# EAGLE design watch mb (EAGLE 9.6.2)
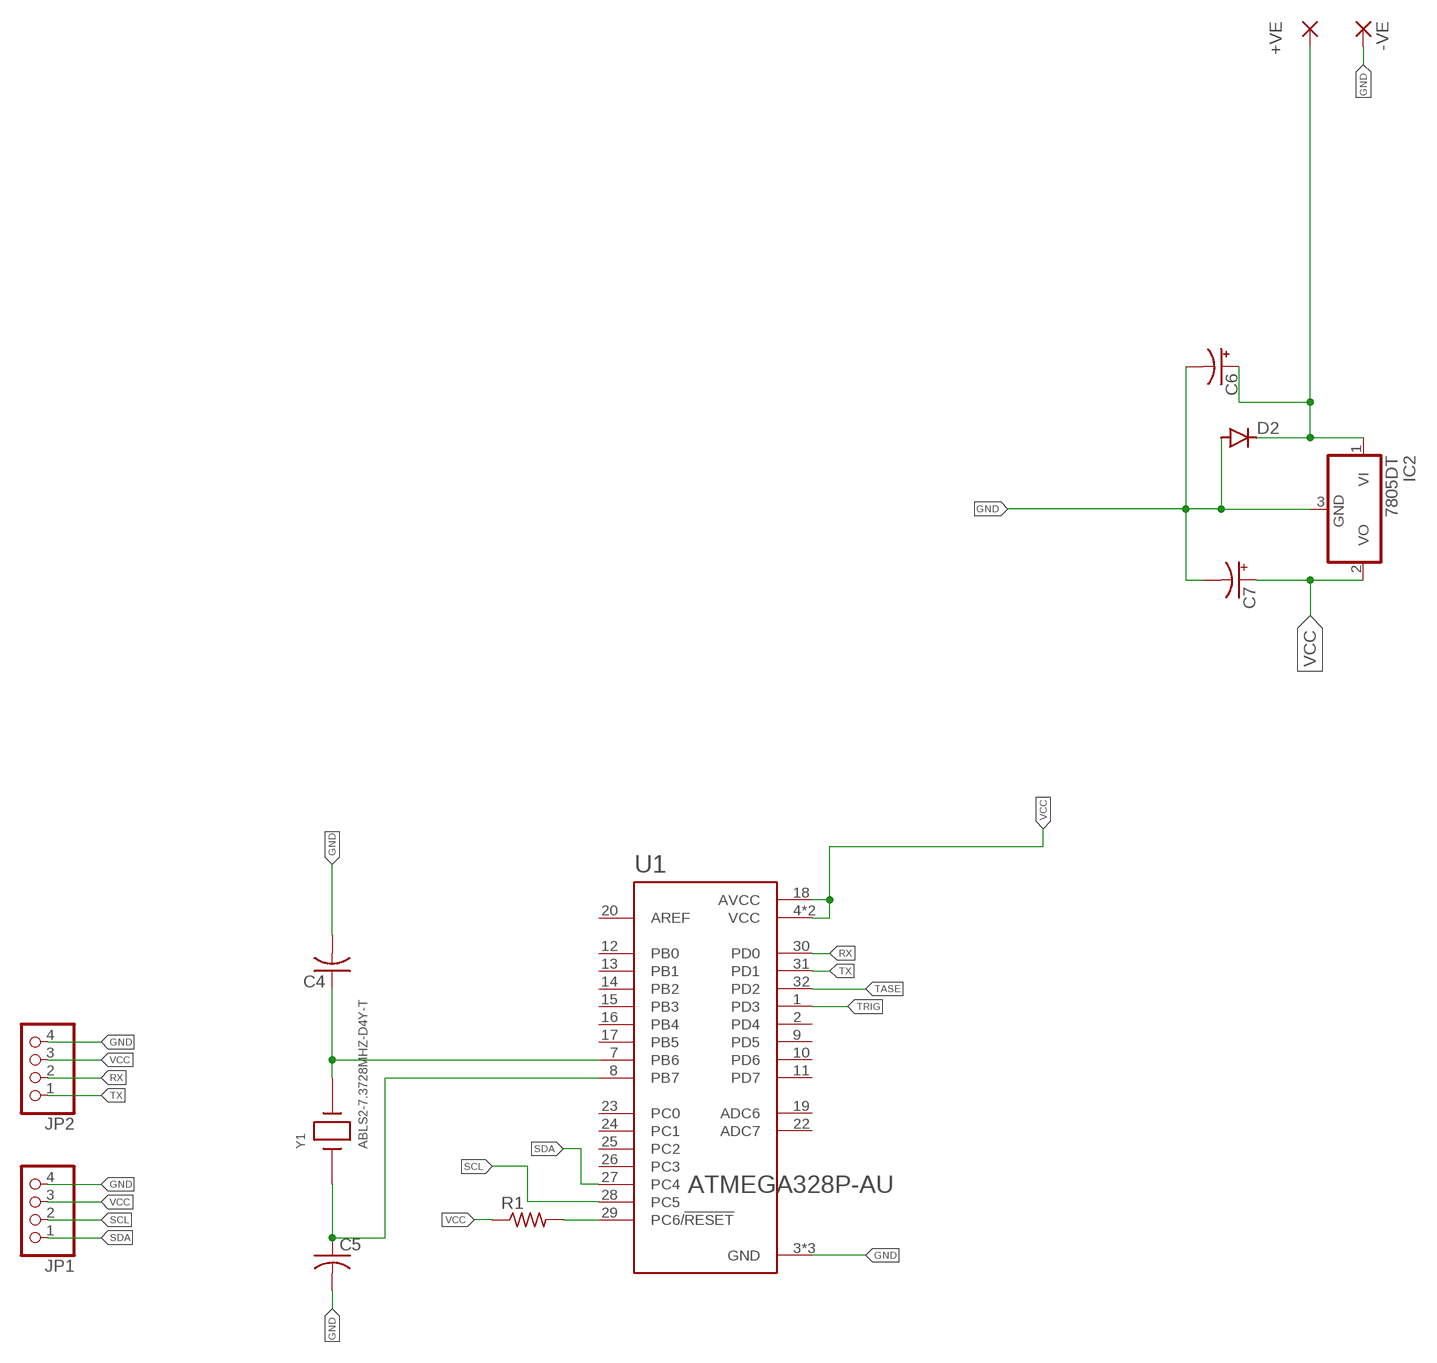
[diagram p0: schematic, sheet 1]

## Parts
+VE  WIREPAD1,6/0,8  [1,6/0,8]
-VE  WIREPAD1,6/0,8  [1,6/0,8]
C4  C-US025-024X044  [C025-024X044]
C5  C-US025-024X044  [C025-024X044]
C6  CPOL-US153CLV-1010  [153CLV-1010]
C7  CPOL-US153CLV-1010  [153CLV-1010]
D2  DIODE-DO214AC  [DO214AC]
IC2  7805DT  [TO252]
JP1  PINHD-1X4  [1X04]
JP2  PINHD-1X4  [1X04]
R1  R-US_R0603  [R0603]
U1  ATMEGA328P-AU  [QFP80P900X900X120-32N]
Y1  ABLS2-7.3728MHZ-D4Y-T  [XTAL_ABLS2-7.3728MHZ-D4Y-T]

## Nets
GND: -VE.1(P) C4.2 C5.2 C6.- C7.- D2.A IC2.3(GND) JP1.4 JP2.4 U1.3(GND) U1.5(GND) U1.21(GND)
N$1: +VE.1(P) C6.+ D2.C IC2.1(VI)
N$3: C4.1 U1.7(PB6) Y1.2
N$5: C5.1 U1.8(PB7) Y1.1
N$7: R1.2 U1.29(PC6/!RESET)
RX: JP2.2 U1.30(PD0)
SCL: JP1.2 U1.28(PC5)
SDA: JP1.1 U1.27(PC4)
TASE: U1.32(PD2)
TRIG: U1.1(PD3)
TX: JP2.1 U1.31(PD1)
VCC: C7.+ IC2.2(VO) JP1.3 JP2.3 R1.1 U1.4(VCC) U1.6(VCC) U1.18(AVCC)
Unconnected: U1.2(PD4) U1.9(PD5) U1.10(PD6) U1.11(PD7) U1.12(PB0) U1.13(PB1) U1.14(PB2) U1.15(PB3) U1.16(PB4) U1.17(PB5) U1.19(ADC6) U1.20(AREF) U1.22(ADC7) U1.23(PC0) U1.24(PC1) U1.25(PC2) U1.26(PC3)

## Library data of the parts
+VE -VE = wirepad:WIREPAD: Wire PAD connect wire on PCB
C4 C5 = rcl:C-US: CAPACITOR, American symbol; SPICEPREFIX: C
C6 C7 = rcl:CPOL-US: POLARIZED CAPACITOR, American symbol; SPICEPREFIX: C
D2 = diode:DIODE-: DIODE
IC2 = linear4:78*: Positive VOLTAGE REGULATOR
JP1 JP2 = pinhead:PINHD-1X4: PIN HEADER
R1 = rcl:R-US_: RESISTOR, American symbol; SPICEPREFIX: R
U1 = ATMEGA328P-AU:ATMEGA328P-AU: ATmega Series 20 MHz 32 KB Flash 2 KB SRAM 8-Bit Microcontroller - TQFP-32 Check prices <https://pricing.snapeda.com/parts/ATMEGA328P-AU/Microchip%20Technology/view-part?ref=eda>; AVAILABILITY: Good; DESCRIPTION: AVR AVR® ATmega Microcontroller IC 8-Bit 20MHz 32KB (16K x 16) FLASH 32-TQFP (7x7); MF: Microchip Technology; MP: ATMEGA328P-AU; PACKAGE: TQFP-32 Microchip; PRICE: None; PURCHASE-URL: https://pricing.snapeda.com/search/part/ATMEGA328P-AU/?ref=eda
Y1 = ABLS2-7.3728MHZ-D4Y-T:ABLS2-7.3728MHZ-D4Y-T: Crystal 24MHz Ø¢Â±30ppm (Tol) Ø¢Â±30ppm (Stability) 18pF FUND 40Ohm 2-Pin HC-49/US SMD T/R Check prices <https://pricing.snapeda.com/parts/ABLS2-7.3728MHZ-D4Y-T/Abracon/view-part?ref=eda>; AVAILABILITY: Good; DESCRIPTION: 7.3728MHz ±30ppm Crystal 18pF 100 Ohms HC-49/US; MF: Abracon; MP: ABLS2-7.3728MHZ-D4Y-T; PACKAGE: HC49/US Abracon; PRICE: None; PURCHASE-URL: https://pricing.snapeda.com/search/part/ABLS2-7.3728MHZ-D4Y-T/?ref=eda

## Board
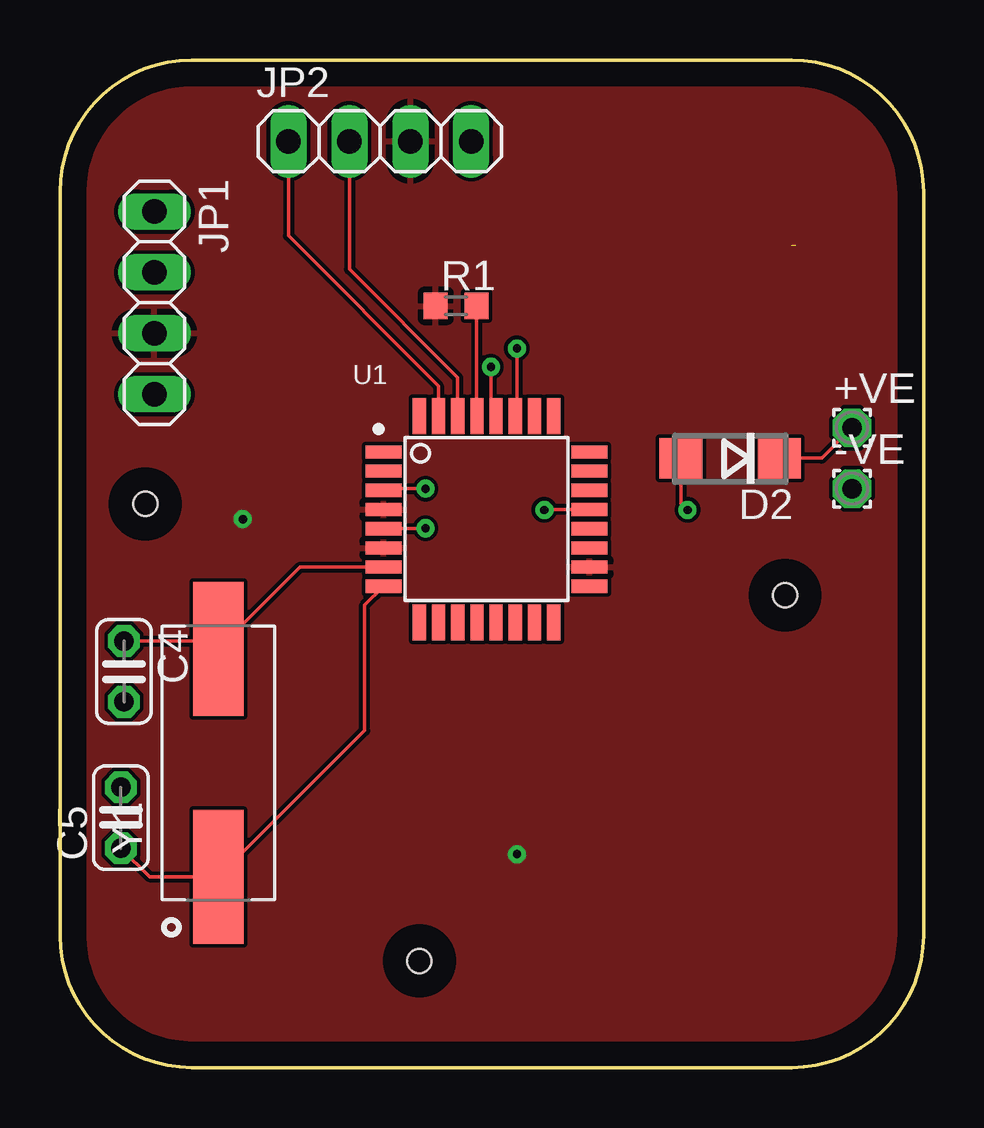
[diagram p1: board, top side]
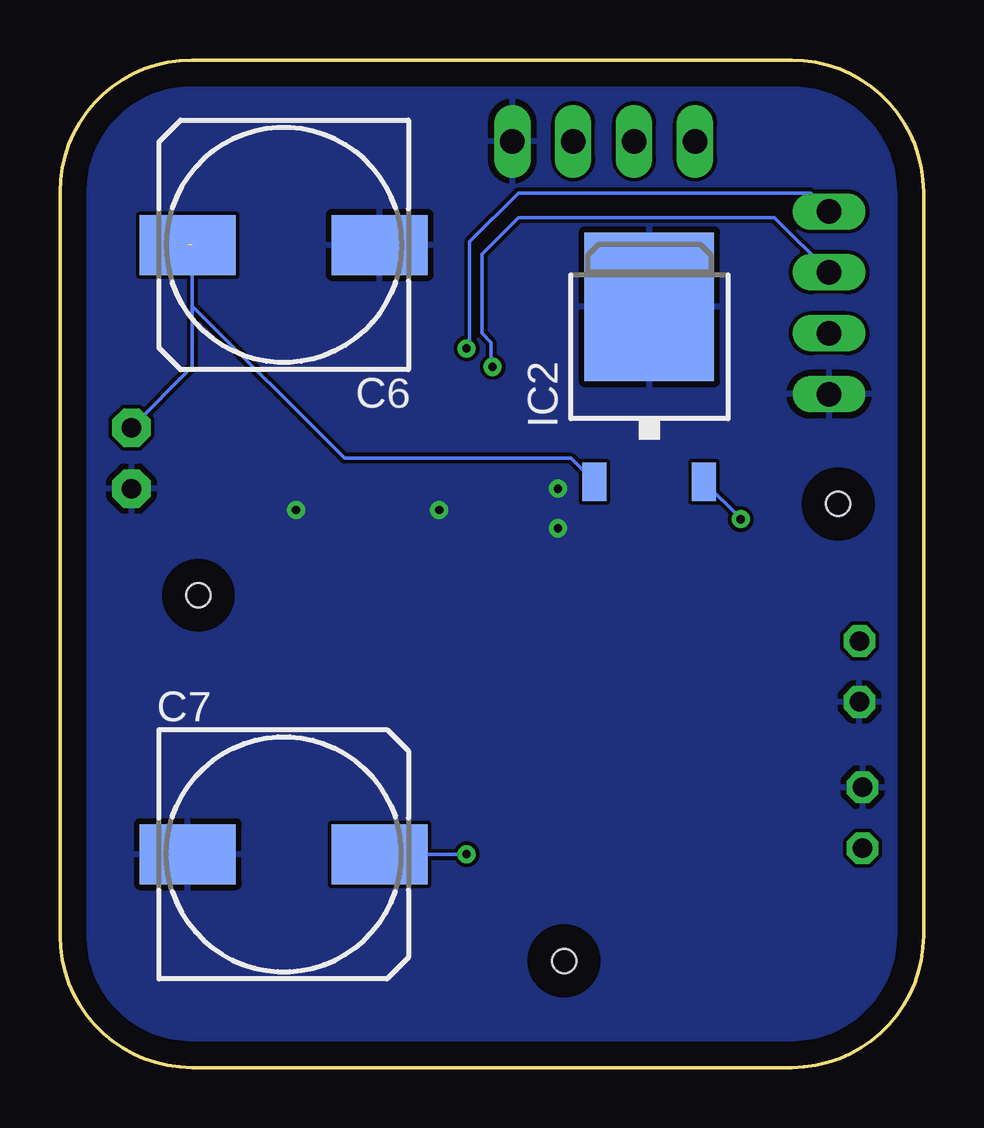
[diagram p2: board, bottom side, seen from below]

Size 36 x 42 mm. Coordinates in mm from the lower left corner, seen from the top.
Outline: 0,5.5 arc90 5.5,0 30.5,0 arc90 36,5.5 36,36.5 arc90 30.5,42 5.5,42 arc90 0,36.5 0,5.5
Copper layers (1*16): Top 0.035mm / dielectric 1.5mm / Bottom 0.035mm
Design rules "default": minimum track width 6mil, minimum drill 0.35mm, track to track 6mil, track to pad 6mil, pad to pad 6mil, via to via 6mil, smd to smd 6mil, copper to edge 40mil, drill to drill 6mil, minimum pad ring 10mil, minimum via ring 8mil, stop-mask expansion 4mil, vias tented up to drill 0mil, thermal gap 10mil
Holes 1 mm at 14.99,4.45 3.56,23.49 30.23,19.69

### Footprints (pad centres in the part's own frame; a part is rotated, then mirrored left to right if it is on the bottom)
1,6/0,8 = drill 0.813 pad 1.6 octagon: 1 0,0
C025-024X044 = drill 0.813 octagon: 1 -1.27,0; 2 1.27,0
153CLV-1010 = smd 4 x 2.5: + 4,0; - -4,0
DO214AC = smd 1.8 x 1.7: A 2.05,0; C -2.05,0
TO252 = smd 1 x 1.6: 1 -2.28,-4.8; 2 2.28,-4.8 | smd 5.4 x 6.2: 3 0,2.5
1X04 = drill 1.016 long: 1 -3.81,0; 2 -1.27,0; 3 1.27,0; 4 3.81,0
R0603 = smd 1 x 1.1: 1 -0.85,0; 2 0.85,0
QFP80P900X900X120-32N = smd 1.5 x 0.55: 1 -4.3,2.8; 2 -4.3,2; 3 -4.3,1.2; 4 -4.3,0.4; 5 -4.3,-0.4; 6 -4.3,-1.2; 7 -4.3,-2; 8 -4.3,-2.8; 17 4.3,-2.8; 18 4.3,-2; 19 4.3,-1.2; 20 4.3,-0.4; 21 4.3,0.4; 22 4.3,1.2; 23 4.3,2; 24 4.3,2.8 | smd 0.55 x 1.5: 9 -2.8,-4.3; 10 -2,-4.3; 11 -1.2,-4.3; 12 -0.4,-4.3; 13 0.4,-4.3; 14 1.2,-4.3; 15 2,-4.3; 16 2.8,-4.3; 25 2.8,4.3; 26 2,4.3; 27 1.2,4.3; 28 0.4,4.3; 29 -0.4,4.3; 30 -1.2,4.3; 31 -2,4.3; 32 -2.8,4.3
XTAL_ABLS2-7.3728MHZ-D4Y-T = smd 5.6 x 2.1: 1 -4.75,0; 2 4.75,0

### Placement (x,y rotation side)
+VE  33.02,26.67 0 top
-VE  33.02,24.13 0 top
C4  2.67,16.51 270 top
C5  2.54,10.41 90 top
C6  26.67,34.29 180 bottom
C7  26.67,8.89 0 bottom
D2  27.94,25.4 180 top
IC2  11.43,29.21 0 bottom
JP1  3.94,31.88 270 top
JP2  13.34,38.61 0 top
R1  16.51,31.75 0 top
U1  17.78,22.86 0 top
Y1  6.6,12.7 90 top

### Tracks (layer width: path | path; a pad name or v marks a point on that pad's centre or on a via)
GND  (via drill 0.35)
  Top 0.152: U1.3 13.55,24.13 v15.24,24.13 | U1.5 15.09,22.46 15.11,22.48 v15.24,22.48 | U1.21 20.21,23.26 v20.19,23.24 | D2.A 25.89,23.51 v26.16,23.24
  pour Bottom: -7.62,45.72 40.64,45.72 41.91,44.45 41.91,1.27 36.83,-3.81 16.51,-3.81 3.81,-3.81 -7.62,7.62
N$1  (1 unrouted)
  Top 0.152: +VE.1 31.75,25.4 D2.C
  Bottom 0.152: IC2.1 14.7,25.4 24.13,25.4 30.48,31.75 | 30.48,34.29 30.48,31.75 | 30.48,31.75 30.48,29.21 +VE.1
N$3
  Top 0.152: C4.1 6.27,17.78 Y1.2 10.01,20.86 U1.7
N$5
  Top 0.152: C5.1 3.73,7.95 Y1.1 12.7,14.05 12.7,19.28 U1.8
N$7
  Top 0.152: R1.2 17.36,27.18 U1.29
RX
  Top 0.152: JP2.2 12.07,33.27 16.58,28.76 U1.30
SCL  (via drill 0.35)
  Top 0.152: v17.97,29.21 17.97,27.37 U1.28
  Bottom 0.152: JP1.2 6.22,35.43 16.89,35.43 18.41,33.91 18.41,30.61 18.03,30.23 18.03,29.28 v17.97,29.21
SDA  (via drill 0.35)
  Top 0.152: v19.05,29.97 19.05,27.23 U1.27
  Bottom 0.152: JP1.1 4.7,36.45 16.89,36.45 18.92,34.42 18.92,29.97 v19.05,29.97
TX
  Top 0.152: JP2.1 9.52,34.67 15.78,28.42 U1.31
VCC  (via drill 0.35)
  Bottom 0.152: IC2.2 7.62,22.88 v7.62,22.86 | C7.+ v19.05,8.89
  pour Top: -7.62,46.99 39.37,46.99 40.64,45.72 40.64,-3.81 2.54,-3.81 -10.16,8.89 -10.16,44.45